# EAGLE design current_monitor_v2 (EAGLE 6.5.0)
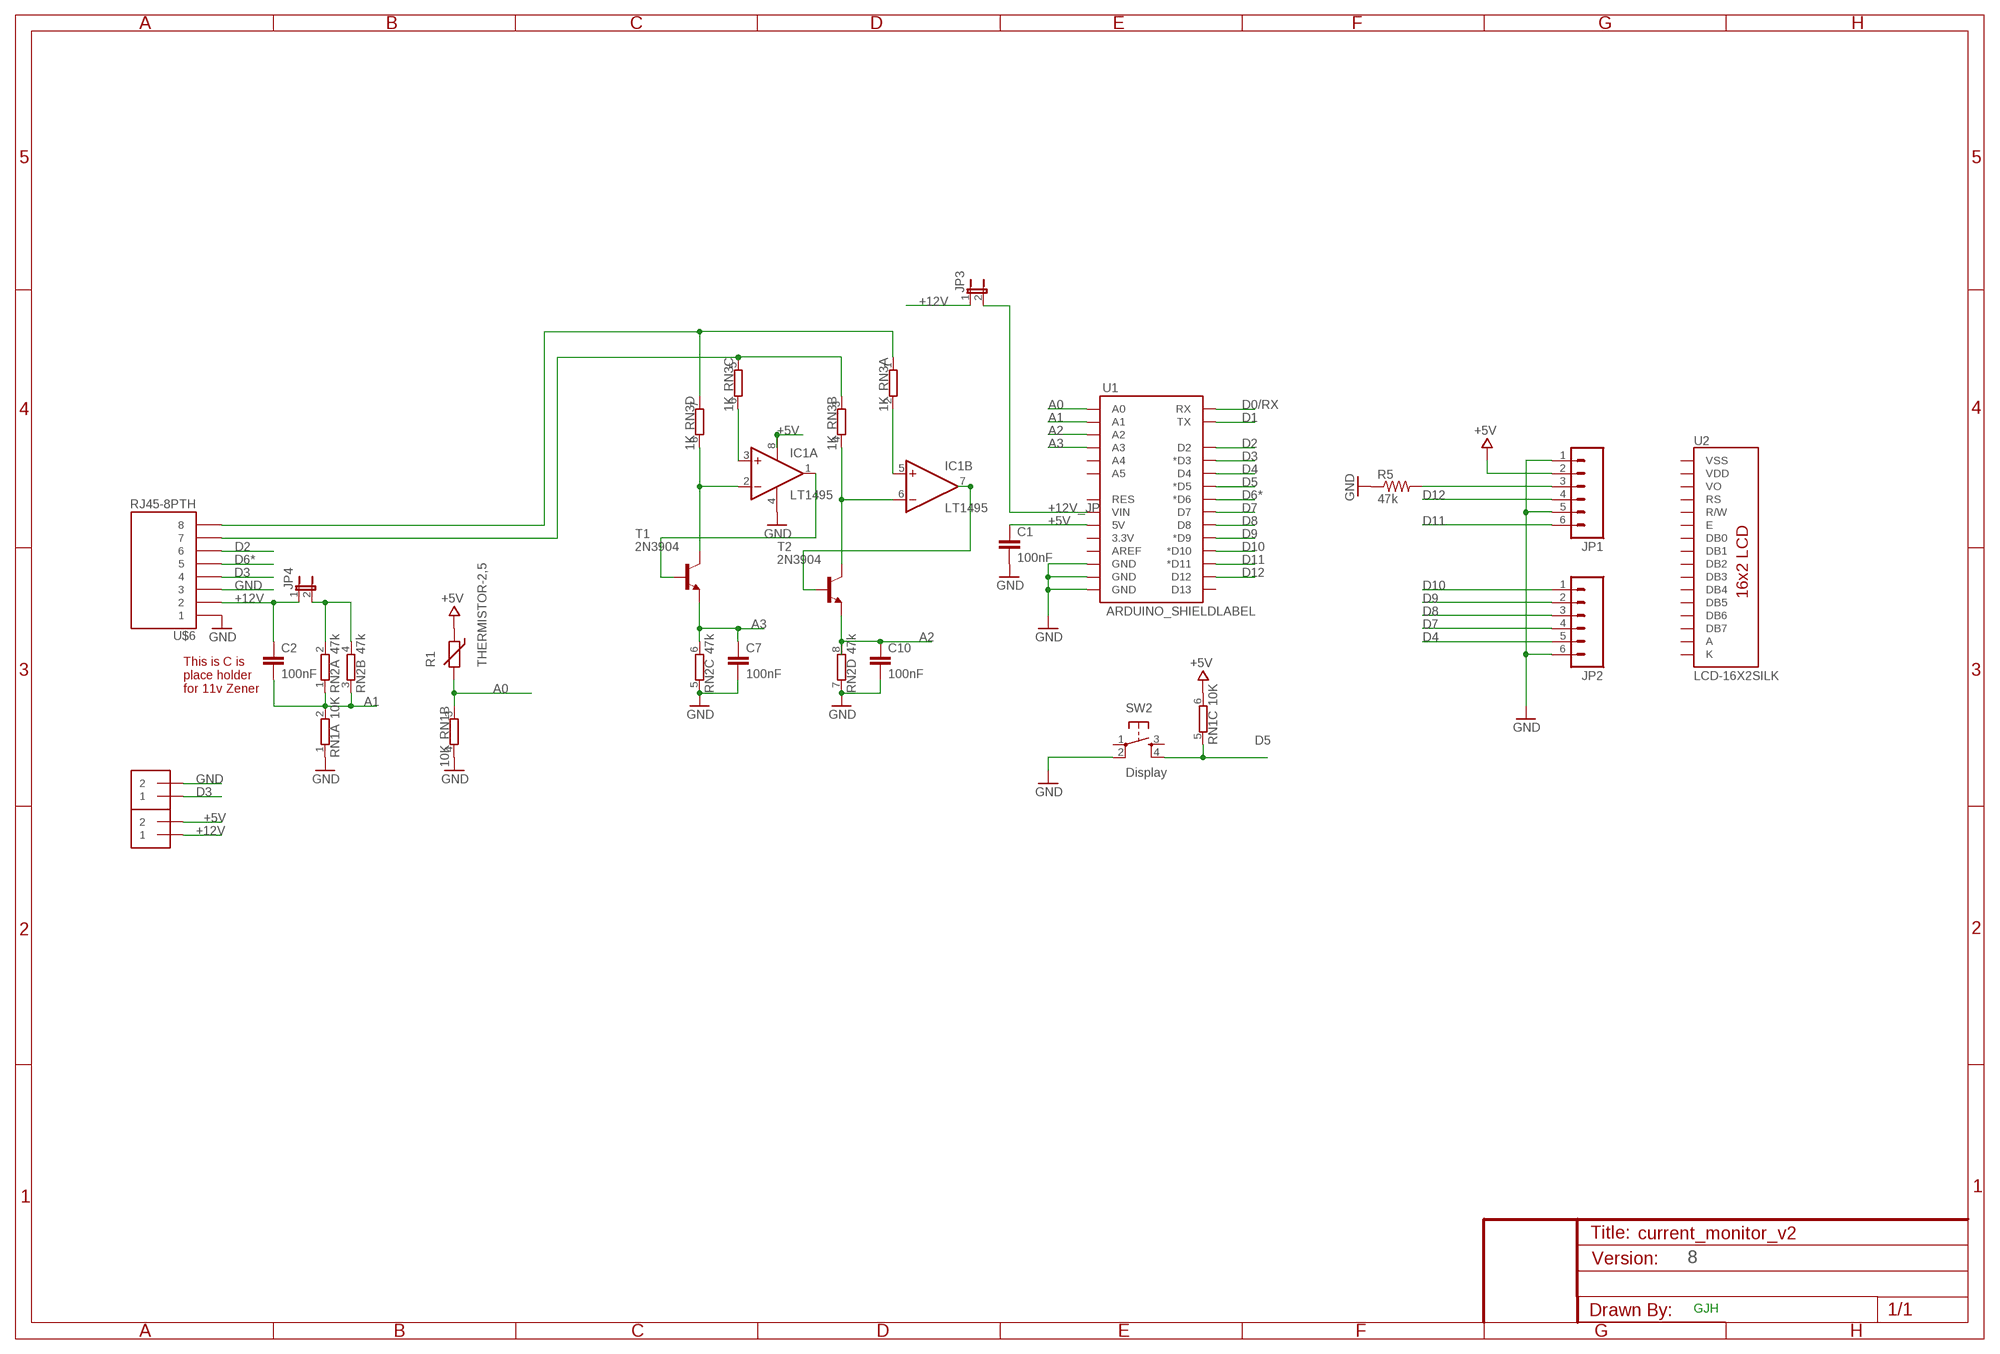
[diagram p0: schematic, sheet 1]

## Parts
C1  100nF  CAPPTH1  [CAP-PTH-5MM]
C2  100nF  CAPPTH1  [CAP-PTH-5MM]
C7  100nF  CAPPTH1  [CAP-PTH-5MM]
C10  100nF  CAPPTH1  [CAP-PTH-5MM]
IC1  LT1495  TL072S  [SOCKED-08]
J1  1X2-3.5MM  [1X2-3.5MM]
J2  1X2-3.5MM  [1X2-3.5MM]
JP1  M06FEMALE_LOCK  [1X06_FEMALE_LOCK.010]
JP2  M06FEMALE_LOCK  [1X06_FEMALE_LOCK.010]
JP3  JUMPER-2PTH  [1X02]
JP4  JUMPER-2PTH  [1X02]
R1  THERMISTOR-2,5  [RS-2,5]
R5  47k  RESISTORAXIAL-0.3  [AXIAL-0.3]
RN1  10K  E3R  [SIL6]
RN2  47k  E4R  [SIL8]
RN3  1K  E4R  [SIL8]
SW2  Display  TAC_SWITCHPTH  [TACTILE-PTH]
T1  2N3904  2N2222  [TO92-EBC-OVAL]
T2  2N3904  2N2222  [TO92-EBC-OVAL]
U1  ARDUINO_SHIELDLABEL  [DUEMILANOVE_SHIELD]
U2  LCD-16X2SILK  [LCD-16X2]
U$6  RJ45-8PTH  [RJ45-8]

## Nets
+5V [power]: C1.1 IC1.8(A:V+) J2.2 JP1.2 R1.1 RN1.6 U1.5V
+12V: C2.1 J2.1 JP3.1 JP4.1 U$6.2
+12V_JP: JP3.2 U1.VIN
+12V_JP2: JP4.2 RN2.2 RN2.4
A0: R1.2 RN1.3 U1.A0
A1: C2.2 RN1.2 RN2.1 RN2.3 U1.A1
A2: C10.1 RN2.8 T2.E U1.A2
A3: C7.1 RN2.6 T1.E U1.A3
D0/RX: U1.RX
D1: U1.TX
D2: U1.D2 U$6.6
D3: J1.1 U1.D3(*D3) U$6.4
D4: JP2.5 U1.D4
D5: RN1.5 SW2.4 U1.D5(*D5)
D6*: U1.D6(*D6) U$6.5
D7: JP2.4 U1.D7
D8: JP2.3 U1.D8
D9: JP2.2 U1.D9(*D9)
D10: JP2.1 U1.D10(*D10)
D11: JP1.6 U1.D11(*D11)
D12: JP1.4 U1.D12
GND [gnd]: C1.2 C7.2 C10.2 IC1.4(A:V-) J1.2 JP1.1 JP1.5 JP2.6 R5.P$1 RN1.1 RN1.4 RN2.5 RN2.7 SW2.2 U1.GND@0(GND) U1.GND@1(GND) U1.GND@2(GND) U$6.1 U$6.3
N$1: IC1.2(A:-IN) RN3.8 T1.C
N$2: IC1.5(B:+IN) RN3.2
N$3: IC1.6(B:-IN) RN3.4 T2.C
N$4: IC1.1(A:OUT) T1.B
N$5: IC1.7(B:OUT) T2.B
N$6: IC1.3(A:+IN) RN3.6
N$7: RN3.1 RN3.7 U$6.8
N$8: RN3.3 RN3.5 U$6.7
N$12: JP1.3 R5.P$2
Unconnected: SW2.1 SW2.3 U1.3.3V U1.A4 U1.A5 U1.AREF U1.D13 U1.RES U2.3(VO) U2.4(RS) U2.5(R/W) U2.6(E) U2.7(DB0) U2.8(DB1) U2.9(DB2) U2.10(DB3) U2.11(DB4) U2.12(DB5) U2.13(DB6) U2.14(DB7)

## Notes on the sheet
- This is C is 
  place holder 
  for 11v Zener
- 8
- GJH

## Power pins joined to a net without a drawn wire
A: U2.15(A)
K: U2.16(K)
VDD: U2.2(VDD)
VSS: U2.1(VSS)

## Library data of the parts
C1 C2 C7 C10 = SparkFun-Passives:CAP: Capacitor Standard 0603 ceramic capacitor, and 0.1" leaded capacitor.
IC1 = ee2parts:TL072
J1 J2 = adafruit:1X2: 3.5mm Terminal block http://www.ladyada.net/library/pcb/eaglelibrary.html
JP1 JP2 = SparkFun-Connectors:M06: Header 6 Standard 6-pin 0.1" header. Use with straight break away headers (SKU : PRT-00116), right angle break away headers (PRT-00553), swiss pins (PRT-00743), machine pins (PRT-00117), and female headers (PRT-00115). Molex polarized connector foot print use with SKU : PRT-08094 with associated crimp pins and housings. NOTES ON THE VARIANTS LOCK and LOCK_LONGPADS... This footprint was designed to help hold the alignment of a through-hole component (i.e. 6-pin header) while soldering it into place. You may notice that each hole has been shifted either up or down by 0.005 of an inch from it's more standard position (which is a perfectly straight line). This slight alteration caused the pins (the squares in the middle) to touch the edges of the holes. Because they are alternating, it causes a "brace" to hold the component in place. 0.005 has proven to be the perfect amount of "off-center" position when using our standard breakaway headers. Although looks a little odd when you look at the bare footprint, once you have a header in there, the alteration is very hard to notice. Also, if you push a header all the way into place, it is covered up entirely on the bottom side. This idea of altering the position of holes to aid alignment will be further integrated into the Sparkfun Library for other footprints. It can help hold any component with 3 or more connection pins.
JP3 JP4 = SparkFun-Passives:JUMPER-2: Jumper Basic 0.1" spaced jumper. Use with breakaway headers.
R1 = varistor:THERMISTOR: THERMISTOR
R5 = SparkFun-Passives:RESISTOR: Resistor Basic schematic elements and footprints for 0603, 1206, and PTH resistors.
RN1 = resistor-sil:E3R: SIL RESISTOR; OC_FARNELL: unknown; OC_NEWARK: unknown
RN2 RN3 = resistor-sil:E4R: SIL RESISTOR; OC_FARNELL: unknown; OC_NEWARK: unknown
SW2 = SparkFun-Electromechanical:TAC_SWITCH: Momentary Switch Button commonly used for reset or general input. Spark Fun Electronics SKU : COM-00097
T1 T2 = adafruit:2N2222: NPN TRANSISTOR Big oval pads
U1 = SparkFun-Boards:ARDUINO_SHIELD: Arduino shield footprint
U2 = SparkFun-Displays:LCD-16X2: Standard text-only 16x2 parallel input LCD
U$6 = SparkFun-Connectors:RJ45-8: RJ45 Jack Simple RJ45, 8-pin connection - connector for common Cat5, Cat5e, and Cat6 Ethernet cables. Footprint not yet proven in production. Connector sku is PRT-00643; Breakout PCB sku is BOB-00716.

## Net classes
0 default: width 0.203 mm, drill 0.406 mm, clearance 0.203 mm
1 power: width 0.203 mm, drill 0.406 mm, clearance 0.203 mm
2 gnd: width 0.203 mm, drill 0.406 mm, clearance 0.203 mm
3 usbvcc: width 0.203 mm, drill 0.406 mm, clearance 0.203 mm
4 aref: width 0.203 mm, drill 0.406 mm, clearance 0.203 mm

## Board
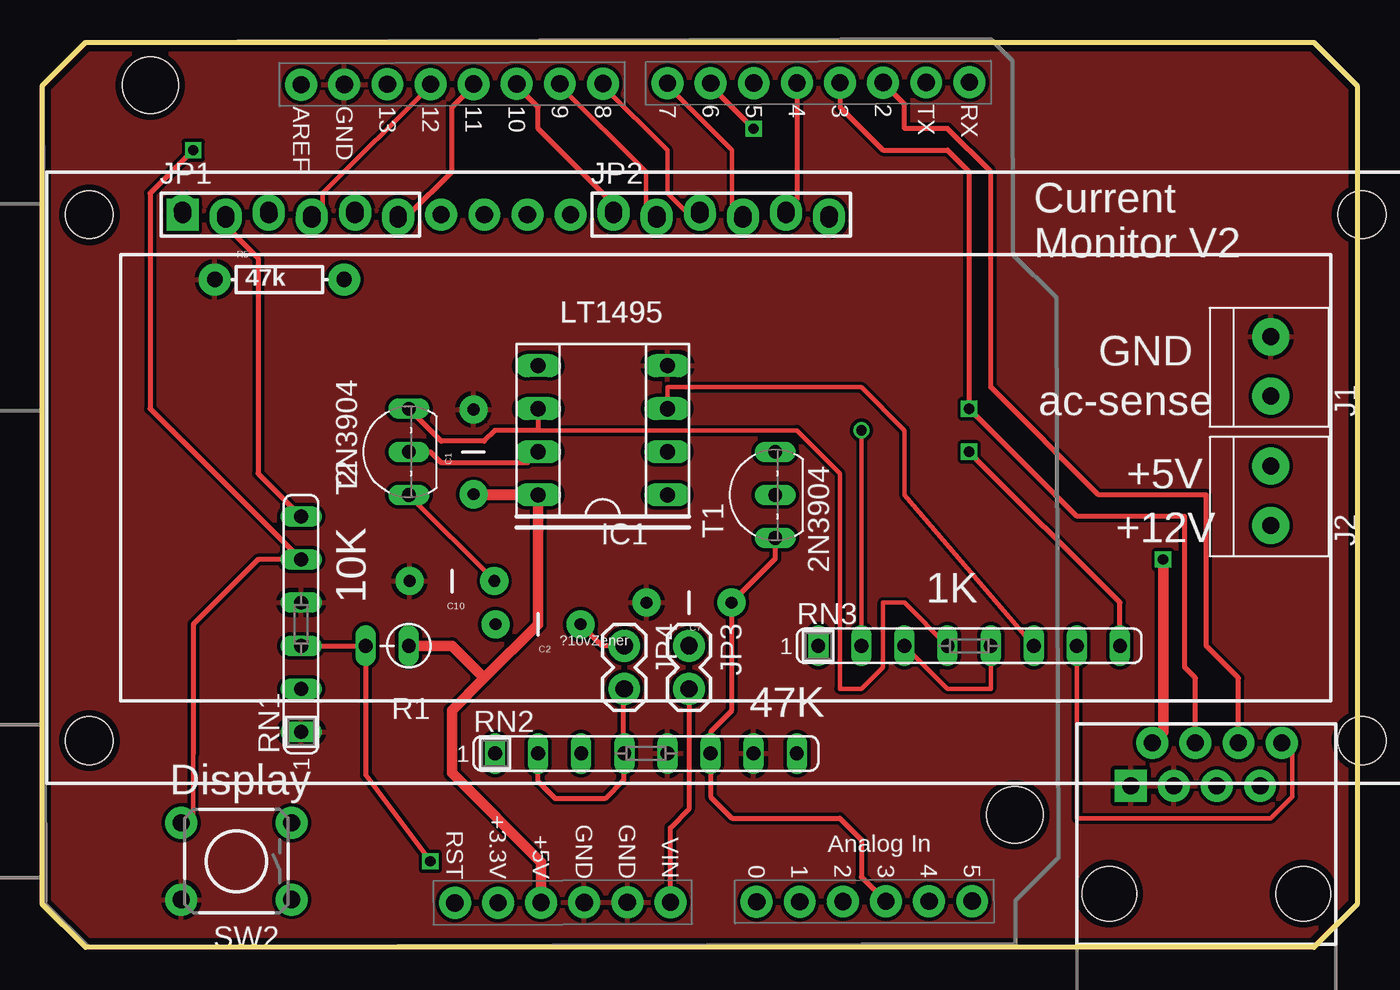
[diagram p1: board, top side]
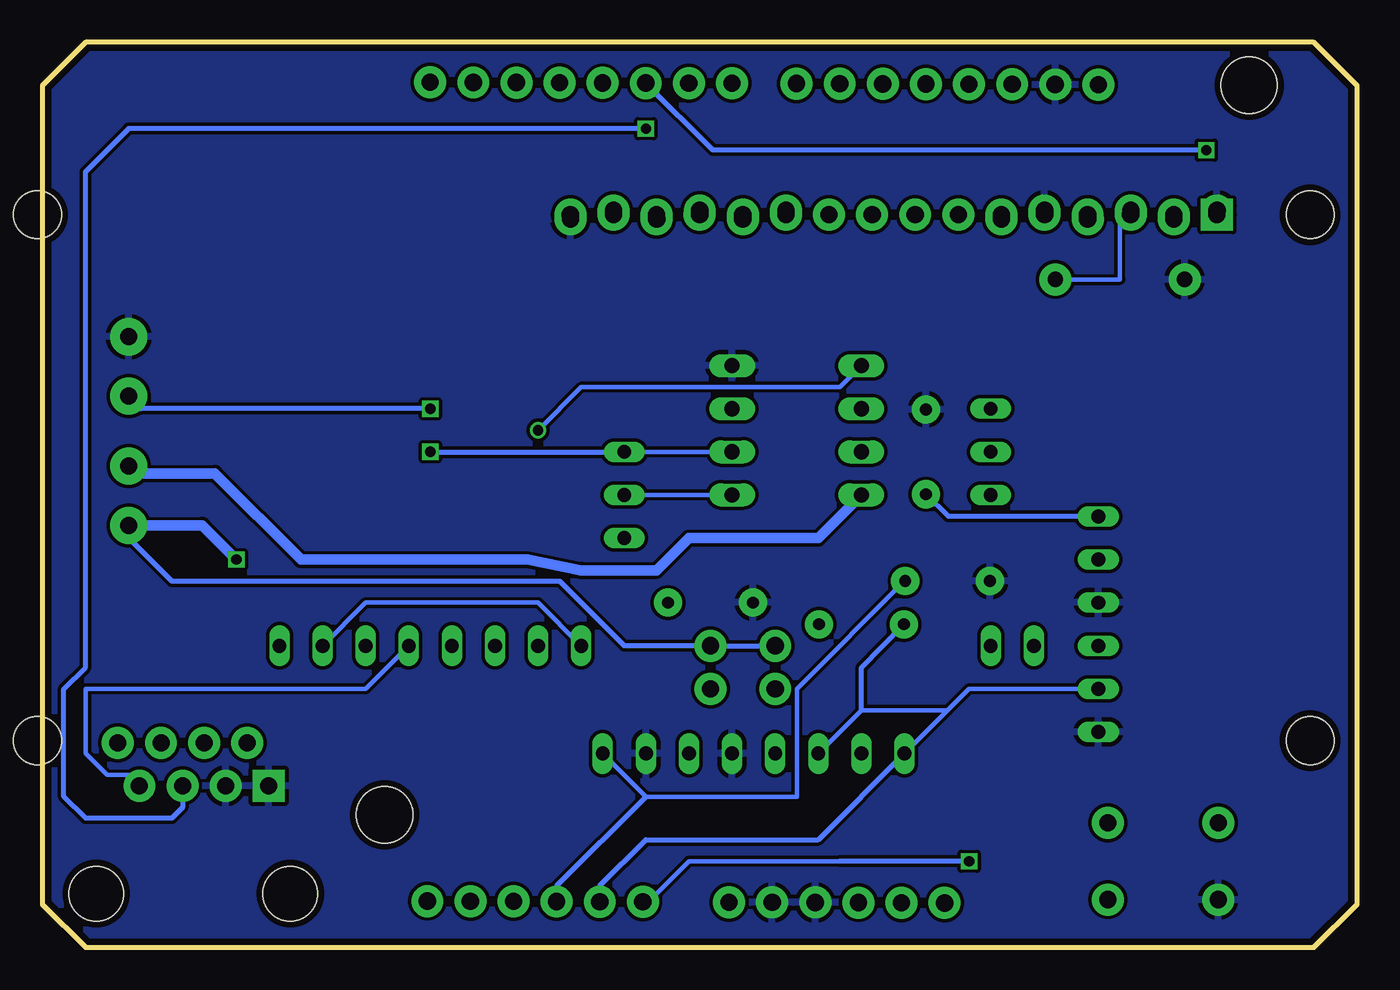
[diagram p2: board, bottom side, seen from below]

Size 77.47 x 53.34 mm. Coordinates in mm from the lower left corner, seen from the top.
Outline: 0,2.54 0,50.8 2.54,53.34 74.93,53.34 77.47,50.8 77.47,2.54 74.93,0 2.54,0 0,2.54
Copper layers (1*16): Top 0.0356mm / dielectric 1.5011mm / Bottom 0.0356mm
Design rules "LaenPCBOrder": minimum track width 6mil, minimum drill 13mil, track to track 6mil, track to pad 6mil, pad to pad 6mil, via to via 6mil, smd to smd 6mil, copper to edge 15mil, drill to drill 6mil, minimum pad ring 7mil, minimum via ring 7mil, stop-mask expansion 4mil, vias tented up to drill 0mil, thermal gap 10mil

### Footprints (pad centres in the part's own frame; a part is rotated, then mirrored left to right if it is on the bottom)
CAP-PTH-5MM = drill 0.7 pad 1.651: 1 -2.5,0; 2 2.5,0
SOCKED-08 = drill 0.9 long: 1 -3.81,-3.81; 2 -1.27,-3.81; 3 1.27,-3.81; 4 3.81,-3.81; 5 3.81,3.81; 6 1.27,3.81; 7 -1.27,3.81; 8 -3.81,3.81
1X2-3.5MM = drill 1 pad 2.184: 1 1.8,0; 2 -1.7,0
1X06_FEMALE_LOCK.010 = drill 1.016 pad 1.88: 1 0,0.254; 2 2.54,-0.254; 3 5.08,0.254; 4 7.62,-0.254; 5 10.16,0.254; 6 12.7,-0.254
1X02 = drill 1.016 pad 1.88: 1 0,0; 2 2.54,0
RS-2,5 = drill 0.813 long: 1 -1.27,0; 2 1.27,0
AXIAL-0.3 = drill 0.9 pad 1.88: P$1 -3.81,0; P$2 3.81,0
SIL6 = drill 0.813 long: 1 -6.35,0; 2 -3.81,0; 3 -1.27,0; 4 1.27,0; 5 3.81,0; 6 6.35,0
SIL8 = drill 0.813 long: 1 -8.89,0; 2 -6.35,0; 3 -3.81,0; 4 -1.27,0; 5 1.27,0; 6 3.81,0; 7 6.35,0; 8 8.89,0
TACTILE-PTH = drill 1.016 pad 1.88: 1 -3.251,2.261; 2 3.251,2.261; 3 -3.251,-2.261; 4 3.251,-2.261
TO92-EBC-OVAL = drill 0.813 long: B 0,-1.27; C 2.54,-1.27; E -2.54,-1.27
DUEMILANOVE_SHIELD = drill 1.016 pad 1.88: 3.3V 50.8,26.67; 5V 50.8,29.21; A0 50.8,41.91; A1 50.8,44.45; A2 50.8,46.99; A3 50.8,49.53; A4 50.8,52.07; A5 50.8,54.61; AREF 2.54,15.24; D2 2.54,49.53; D3 2.54,46.99; D4 2.54,44.45; D5 2.54,41.91; D6 2.54,39.37; D7 2.54,36.83; D8 2.54,33.02; D9 2.54,30.48; D10 2.54,27.94; D11 2.54,25.4; D12 2.54,22.86; D13 2.54,20.32; GND@0 50.8,31.75; GND@1 50.8,34.29; GND@2 2.54,17.78; RES 50.8,24.13; RX 2.54,54.61; TX 2.54,52.07; VIN 50.8,36.83 | hole 3.302: 45.72,57.15; 2.54,6.35
LCD-16X2 = drill 1.016 pad 1.88 square: 1 -32,15.5 | drill 1.016 pad 1.88: 2 -29.46,15.5; 3 -26.92,15.5; 4 -24.38,15.5; 5 -21.84,15.5; 6 -19.3,15.5; 7 -16.76,15.5; 8 -14.22,15.5; 9 -11.68,15.5; 10 -9.14,15.5; 11 -6.6,15.5; 12 -4.06,15.5; 13 -1.52,15.5; 14 1.02,15.5; 15 3.56,15.5; 16 6.1,15.5 | hole 2.8: -37.5,15.5; -37.5,-15.5; 37.5,15.5; 37.5,-15.5
RJ45-8 = drill 1 pad 1.88 square: 1 -4.445,6.35 | drill 1 pad 1.88: 2 -3.175,8.89; 3 -1.905,6.35; 4 -0.635,8.89; 5 0.635,6.35; 6 1.905,8.89; 7 3.175,6.35; 8 4.445,8.89 | hole 3.2: -5.715,0; 5.715,0

### Placement (x,y rotation side)
C1  25.4,29.21 90 top
C2  29.21,19.05 180 top
C7  38.1,20.32 180 top
C10  24.13,21.59 180 top
IC1  33.02,30.48 90 top
J1  72.39,34.29 270 top
J2  72.39,26.67 270 top
JP1  8.26,43.18 0 top
JP2  33.66,43.18 0 top
JP3  38.1,17.78 270 top
JP4  34.29,17.78 270 top
R1  20.32,17.78 180 top
R5  13.97,39.37 0 top
RN1  15.24,19.05 90 top
RN2  35.56,11.43 0 top
RN3  54.61,17.78 0 top
SW2  11.43,5.08 180 top
T1  41.91,26.67 90 top
T2  20.32,29.21 90 top
U1  0,53.34 270.2 top
U2  40.26,27.69 0 top
U$6  68.58,3.17 0 top

### Tracks (layer width: path | path; a pad name or v marks a point on that pad's centre or on a via)
+5V
  Top 0.305: JP1.2 10.79,42.55 12.7,40.64 12.7,27.94 RN1.6
  Top 0.61: IC1.8 25.44,26.67 C1.1 29.17,26.71 IC1.8 | U1.5V 29.39,5.03 24.13,10.29 24.13,13.97 26.04,15.88 | IC1.8 29.21,19.05 26.04,15.88 | R1.1 24.13,17.78 26.04,15.88
  Bottom 0.254: 11.43,43.18 JP1.2 | IC1.8 30.48,25.4 | 72.39,27.94 J2.2
  Bottom 0.305: RN1.6 24.09,25.4 C1.1
  Bottom 0.61: 72.39,27.94 67.31,27.94 62.23,22.86 48.9,22.86 45.72,22.23 41.27,22.23 39.37,24.13 31.75,24.13 IC1.8
+12V  (via drill 0.6)
  Top 0.305: JP4.1 32.98,17.78 C2.1
  Top 0.61: v66.04,22.86 66.04,12.7 U$6.2
  Bottom 0.305: 72.39,24.13 69.85,21.59 46.99,21.59 43.18,17.78 JP3.1 JP4.1
  Bottom 0.61: v66.04,22.86 68.05,24.87 J2.1 72.39,24.13
+12V_JP
  Top 0.305: U1.VIN 37.01,7.06 38.1,8.15 JP3.2
+12V_JP2
  Top 0.305: 34.25,11.47 RN2.4 | 34.25,11.47 34.25,9.87 33.15,8.76 30.23,8.76 29.21,9.78 RN2.2 | 34.25,11.47 34.25,15.2 JP4.2
A0  (via drill 0.6)
  Top 0.305: RN1.3 R1.2 19.05,10.16 v22.86,5.08
  Bottom 0.254: 30.48,5.08 39.37,5.08 41.91,2.54 U1.A0
  Bottom 0.305: v22.86,5.08 30.48,5.08
A1
  Bottom 0.254: 24.13,13.97 22.86,15.24 RN1.2 | 24.13,13.97 RN2.1 | RN2.3 29.21,13.97 24.13,13.97
  Bottom 0.305: RN2.1 31.75,6.35 41.91,6.35 44.63,3.63 U1.A1 | 29.21,13.97 29.21,16.47 C2.2
A2
  Top 0.254: T2.E 26.67,21.59 C10.1
  Bottom 0.254: RN2.8 41.91,8.89 33.02,8.89 33.02,15.24 26.67,21.59 C10.1
  Bottom 0.305: U1.A2 47.17,3.63 41.91,8.89
A3
  Top 0.305: T1.E 43.18,22.9 C7.1 40.6,13.93 39.37,12.7 RN2.6 39.37,8.89 40.64,7.62 46.99,7.62 48.26,6.35 48.26,4.16 U1.A3
D0/RX
  Top 0.254: 54.61,50.8 U1.RX
D1
  Top 0.254: 52.07,50.8 U1.TX
  Top 0.305: U1.TX
D2
  Top 0.305: U$6.6 70.48,15.88 68.58,17.78 68.58,26.67 62.23,26.67 55.88,33.02 55.88,45.72 53.34,48.26 50.8,48.26 50.8,49.71 U1.D2
D3  (via drill 0.6)
  Top 0.305: U1.D3 47,49.52 49.53,46.99 53.34,46.99 54.61,45.72 v54.61,31.75 60.96,25.4 67.31,25.4 67.31,16.51 67.94,15.88 U$6.4
  Bottom 0.254: 46.99,50.8 U1.D3
  Bottom 0.305: v54.61,31.75 71.65,31.75 J1.1
D4
  Top 0.305: U1.D4 44.46,44.08 JP2.5
D5  (via drill 0.6)
  Top 0.254: 8.89,11.43 8.89,7.62 SW2.4
  Top 0.305: v8.89,46.99 6.35,44.45 6.35,31.75 RN1.5 12.7,22.86 8.89,19.05 8.89,11.43
  Bottom 0.254: 41.91,50.8 U1.D5
  Bottom 0.305: v8.89,46.99 37.96,46.99 U1.D5
D6*  (via drill 0.6)
  Top 0.305: U1.D6 39.38,50.79 v41.91,48.26
  Bottom 0.305: v41.91,48.26 72.39,48.26 74.93,45.72 74.93,16.51 76.2,15.24 76.2,8.89 74.93,7.62 69.85,7.62 69.22,8.26 U$6.5
D7
  Top 0.254: JP2.4 40.64,43.18 40.64,46.99 36.83,50.8 U1.D7
D8
  Top 0.254: JP2.3 38.1,43.18 36.83,44.45 36.83,46.99 33.02,50.8 U1.D8
D9
  Top 0.254: JP2.2 35.56,43.18 35.56,45.72 30.48,50.8 U1.D9
D10
  Top 0.254: 27.94,50.8 U1.D10
  Top 0.305: JP2.1 33.66,43.81 29.21,48.26 29.21,49.53 27.94,50.8
D11
  Top 0.254: 21.59,43.18 JP1.6 | 25.4,50.8 U1.D11
  Top 0.305: 21.59,43.18 24.13,45.72 24.13,49.53 25.4,50.8
D12
  Top 0.254: JP1.4 16.51,43.18 16.51,44.45 22.86,50.8 U1.D12
GND
  pour Bottom: 0,0 0,53.34 77.47,53.34 77.47,0
  pour Top: 2.54,0 0,2.54 0,50.8 2.54,53.34 74.93,53.34 77.47,50.8 77.47,2.54 74.93,0
N$1  (via drill 0.6)
  Top 0.305: RN3.8 63.5,20.32 v54.61,29.21
  Bottom 0.254: IC1.2 T1.C
  Bottom 0.305: v54.61,29.21 T1.C
N$2  (via drill 0.61)
  Top 0.254: v48.26,30.48 RN3.2
  Bottom 0.254: v48.26,30.48 45.72,33.02 30.48,33.02 IC1.5
N$3
  Top 0.254: RN3.4 50.8,20.32 49.53,20.32 49.53,16.51 48.26,15.24 46.99,15.24 46.99,27.94 44.45,30.48 29.21,30.48
  Top 0.305: IC1.6 29.21,30.48 26.67,30.48 26.04,29.84 23.5,29.84 T2.C
N$4
  Bottom 0.254: IC1.1 T1.B
N$5
  Top 0.305: T2.B 22.86,29.21 23.5,28.57 28.57,28.57 IC1.7
N$6
  Top 0.254: RN3.6 50.8,26.67 50.8,30.48 48.26,33.02 36.83,33.02 IC1.3
N$7
  Top 0.254: RN3.7 60.96,7.62 72.39,7.62 73.66,8.89 73.66,11.43 U$6.8
  Bottom 0.254: RN3.1 48.26,20.32 58.42,20.32 RN3.7
N$8
  Top 0.254: RN3.3 53.34,15.24 55.88,15.24 RN3.5
  Bottom 0.254: RN3.5 58.42,15.24 74.93,15.24 74.93,11.43 73.66,10.16 72.39,10.16 U$6.7
N$12
  Bottom 0.254: R5.P$2 13.97,39.37 13.97,43.18 JP1.3

### Text on the board
tPlace: Current / Monitor V2 | LT1495 | LT1495 | GND | ac-sense | 2N3904 | +5V | +12V | 2N3904 | 10K | 1K | ?10vZener | 47K | Display